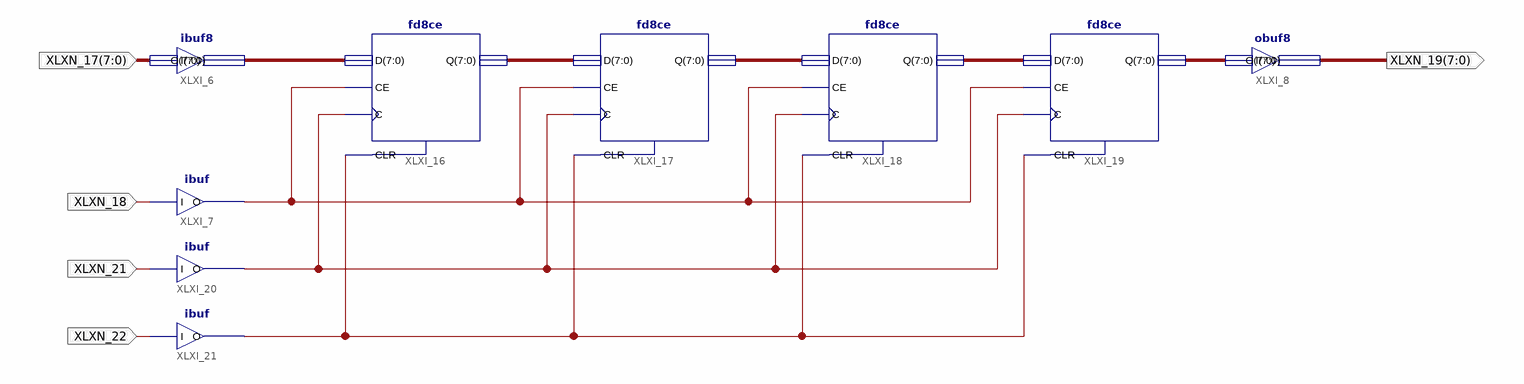
[diagram p0: schematic sheet 1]
// Xilinx ISE schematic fifo.sch (xbr) as structural Verilog: 9 symbols, 5 ports
module fifo (
  input  [7:0] XLXN_17,
  input  XLXN_18,
  input  XLXN_21,
  input  XLXN_22,
  output [7:0] XLXN_19
);

  wire XLXN_23, XLXN_24, XLXN_25;
  wire [7:0] XLXN_1, XLXN_2, XLXN_3, XLXN_9, XLXN_10;

  obuf8 XLXI_8 (.I(XLXN_9), .O(XLXN_19));
  fd8ce XLXI_16 (.C(XLXN_24), .CE(XLXN_23), .CLR(XLXN_25), .D(XLXN_10), .Q(XLXN_1));
  fd8ce XLXI_17 (.C(XLXN_24), .CE(XLXN_23), .CLR(XLXN_25), .D(XLXN_1), .Q(XLXN_2));
  fd8ce XLXI_18 (.C(XLXN_24), .CE(XLXN_23), .CLR(XLXN_25), .D(XLXN_2), .Q(XLXN_3));
  fd8ce XLXI_19 (.C(XLXN_24), .CE(XLXN_23), .CLR(XLXN_25), .D(XLXN_3), .Q(XLXN_9));
  ibuf8 XLXI_6 (.I(XLXN_17), .O(XLXN_10));
  ibuf XLXI_21 (.I(XLXN_22), .O(XLXN_25));
  ibuf XLXI_20 (.I(XLXN_21), .O(XLXN_24));
  ibuf XLXI_7 (.I(XLXN_18), .O(XLXN_23));
endmodule
